# EAGLE schematic base (EAGLE 9.2.1)
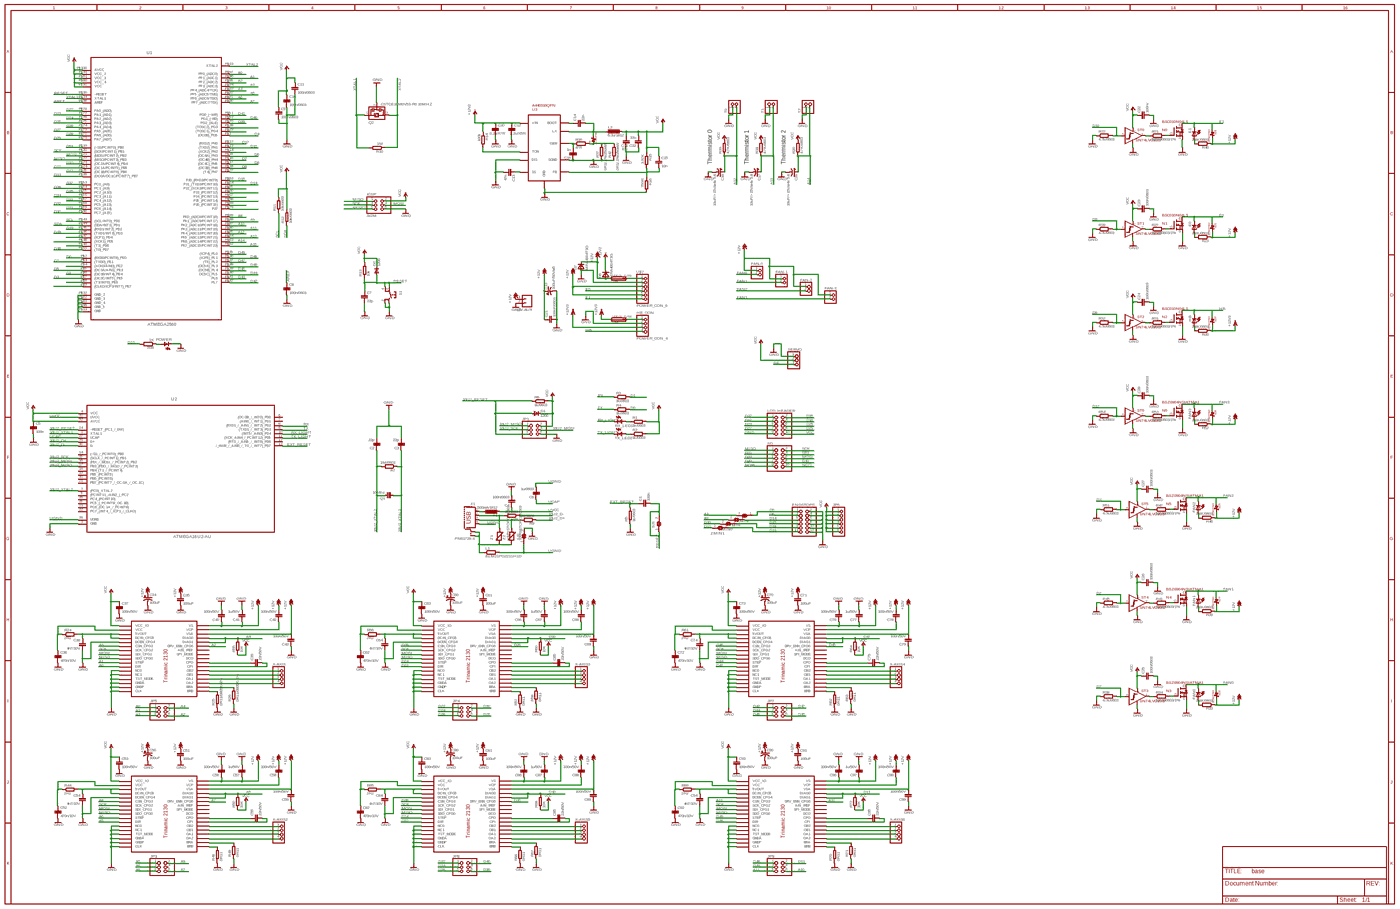
[diagram p0: schematic, sheet 1, overview]
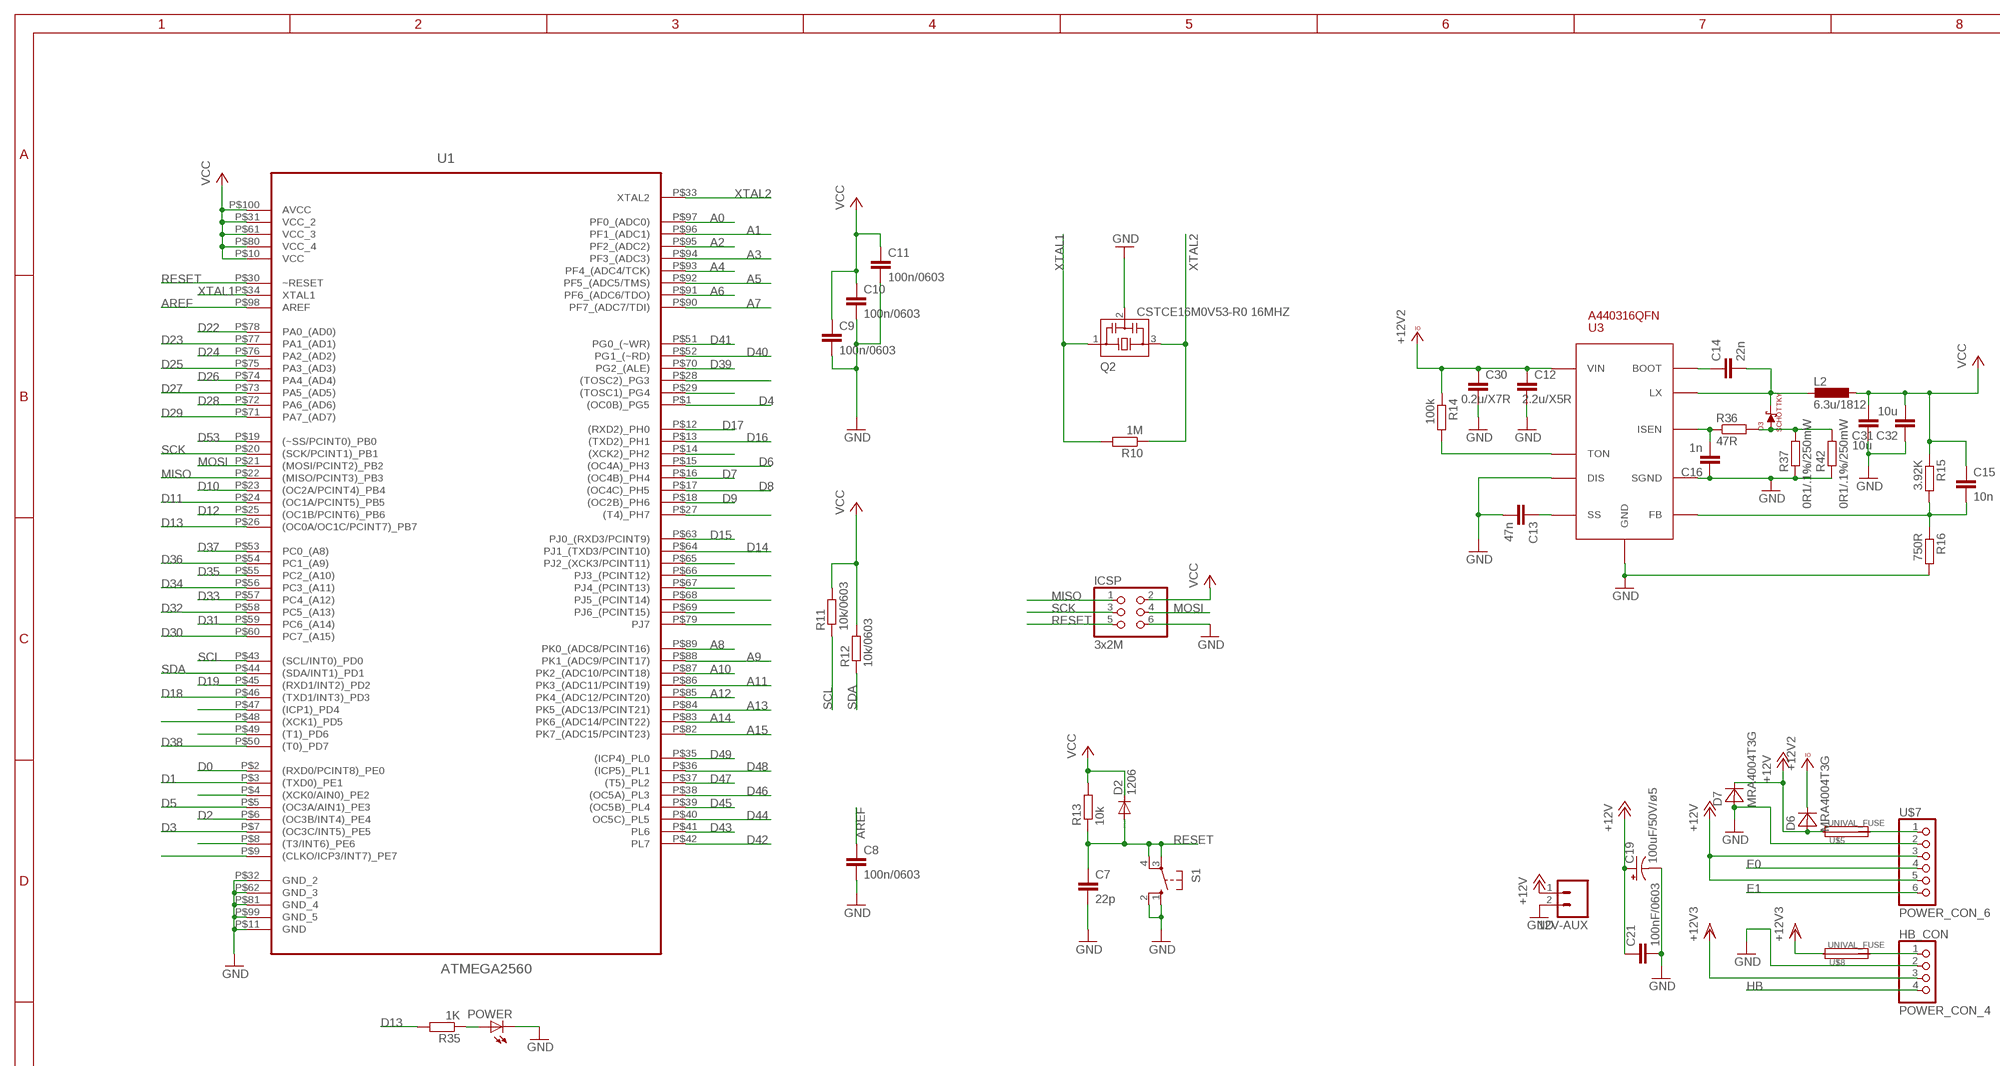
[diagram p1: schematic, sheet 1, part 1 of 4]
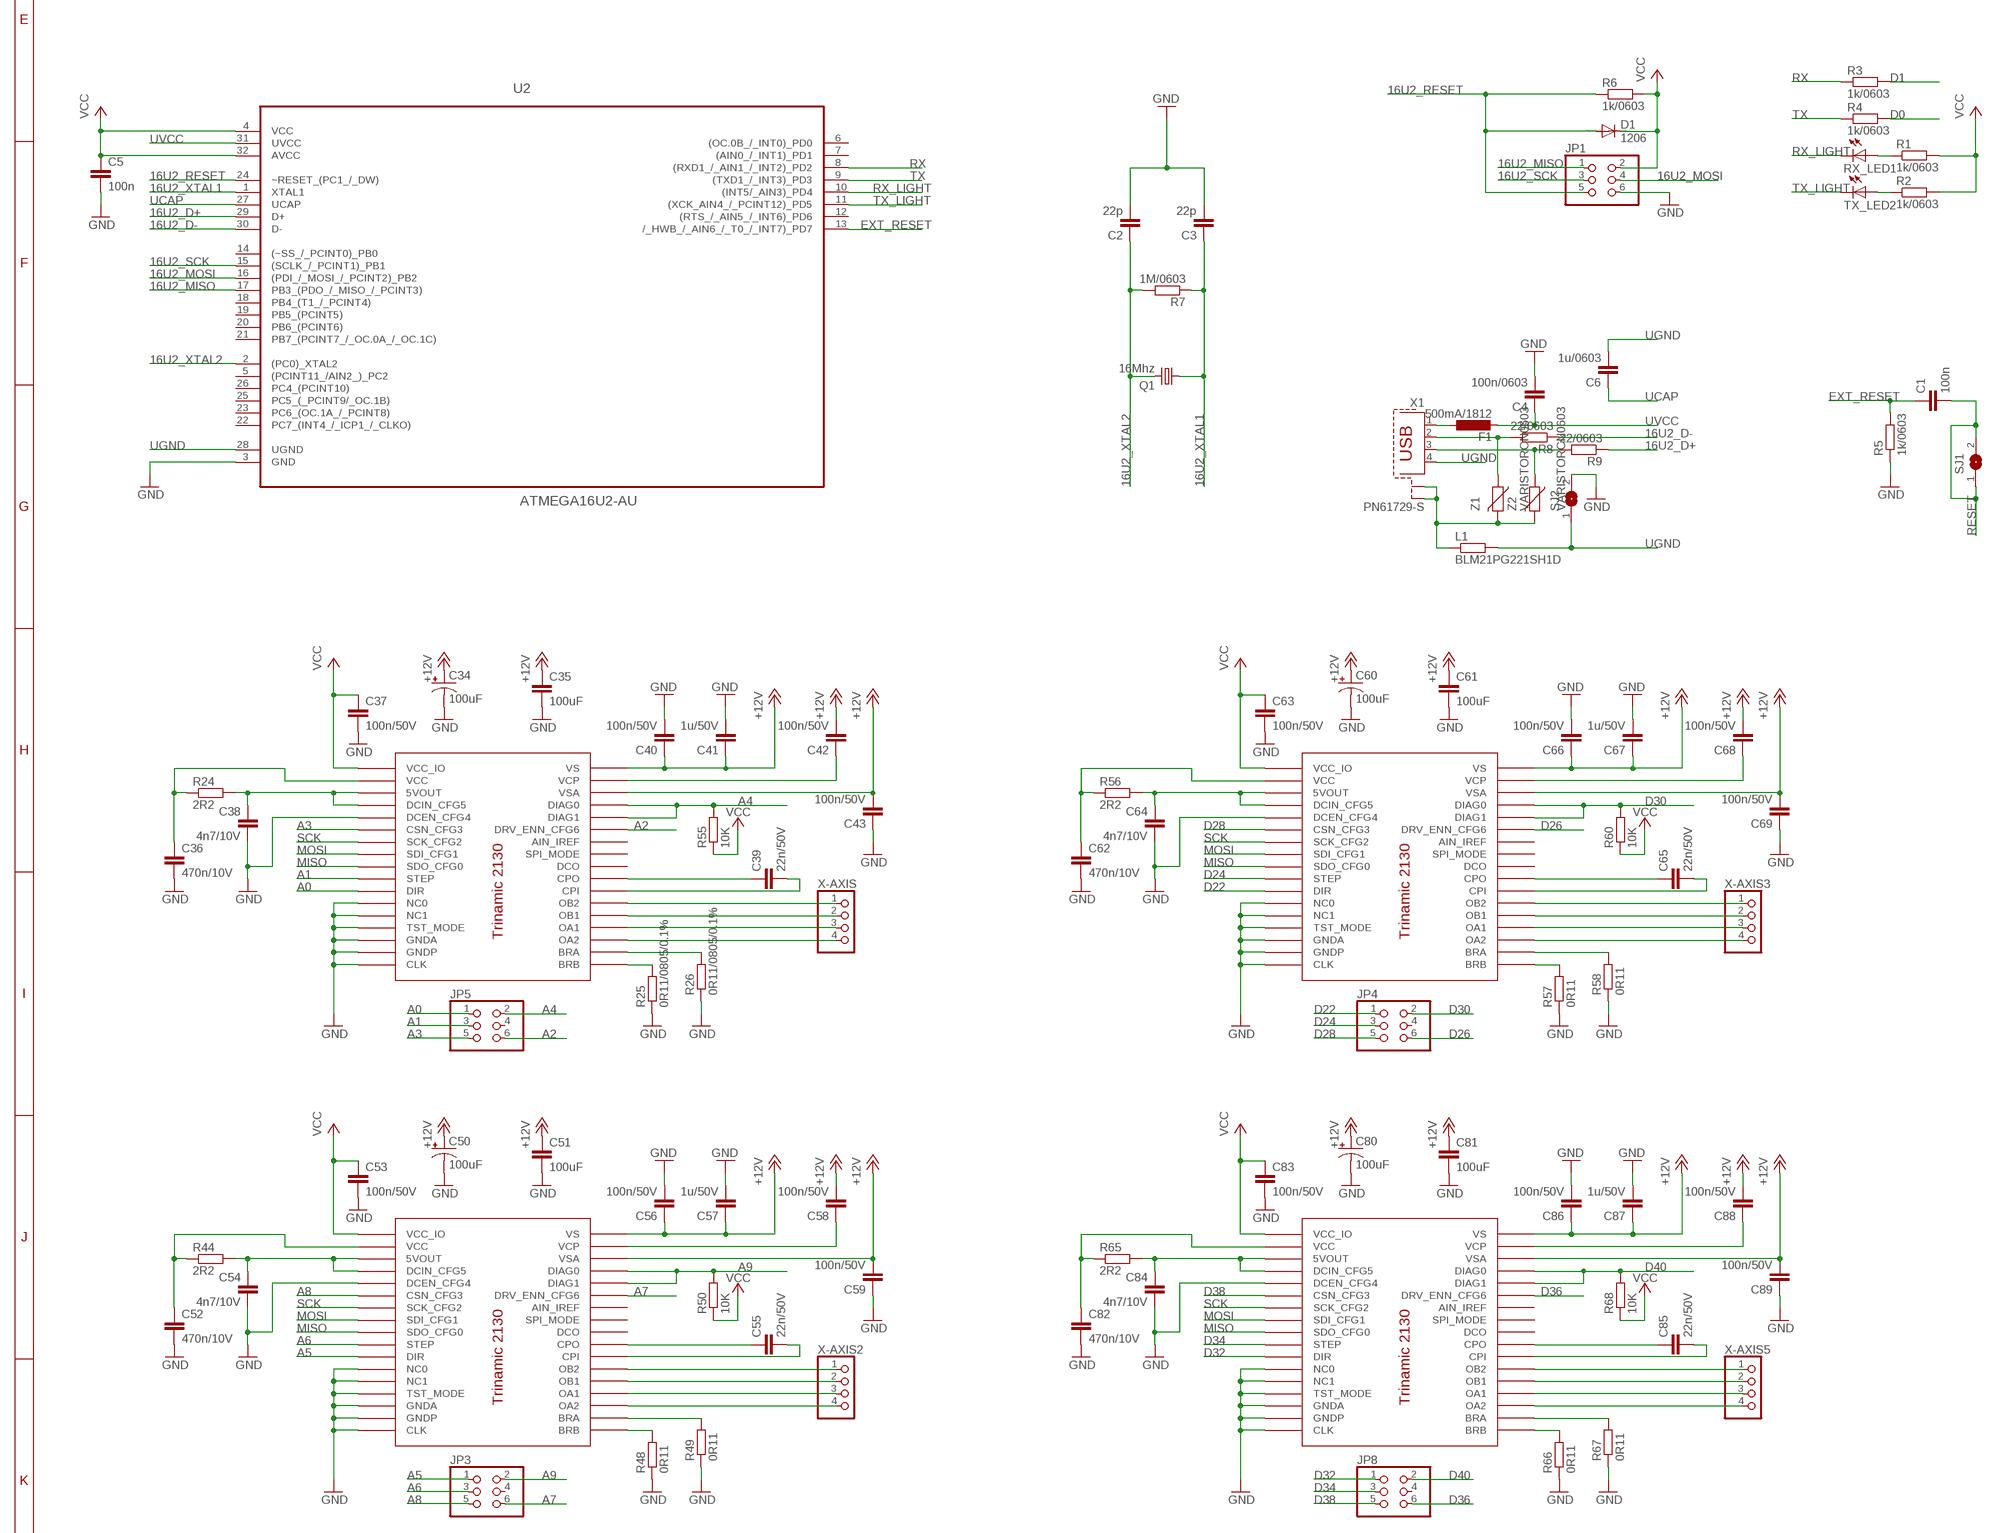
[diagram p2: schematic, sheet 1, part 2 of 4]
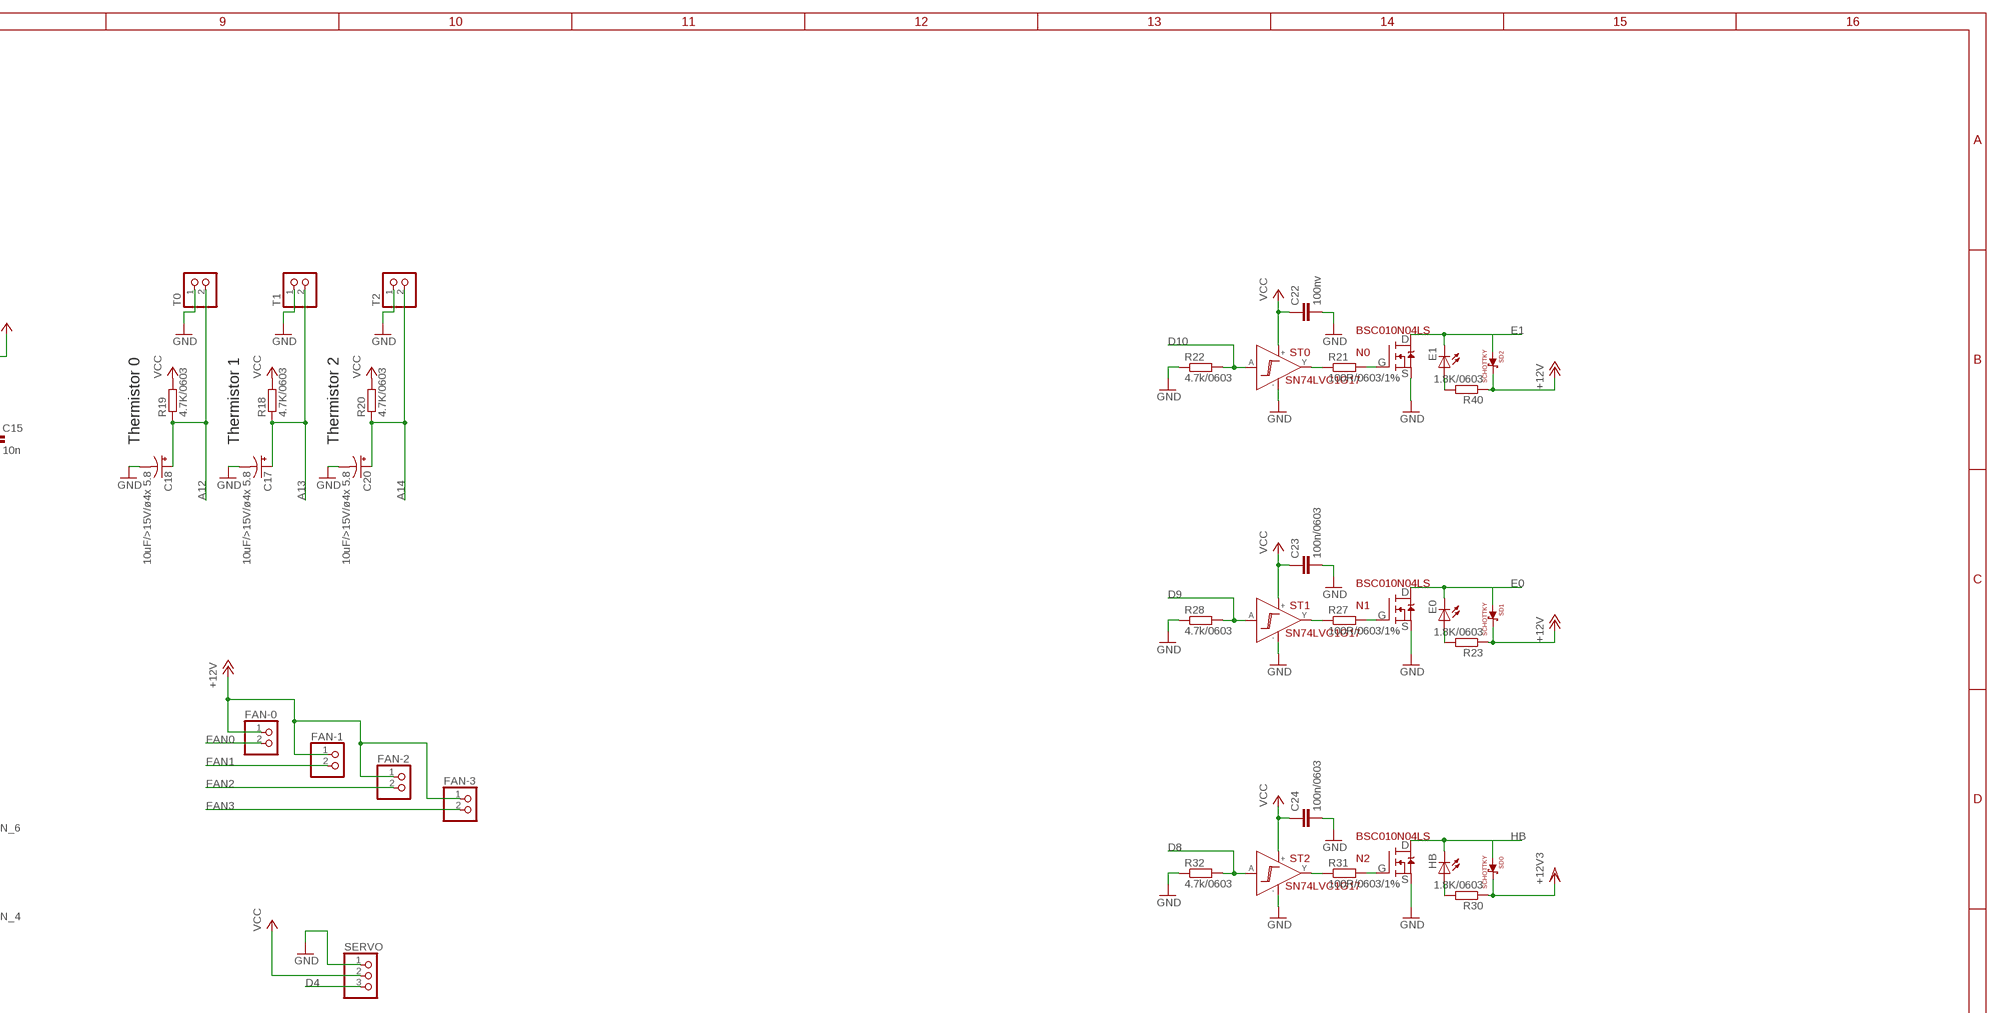
[diagram p3: schematic, sheet 1, part 3 of 4]
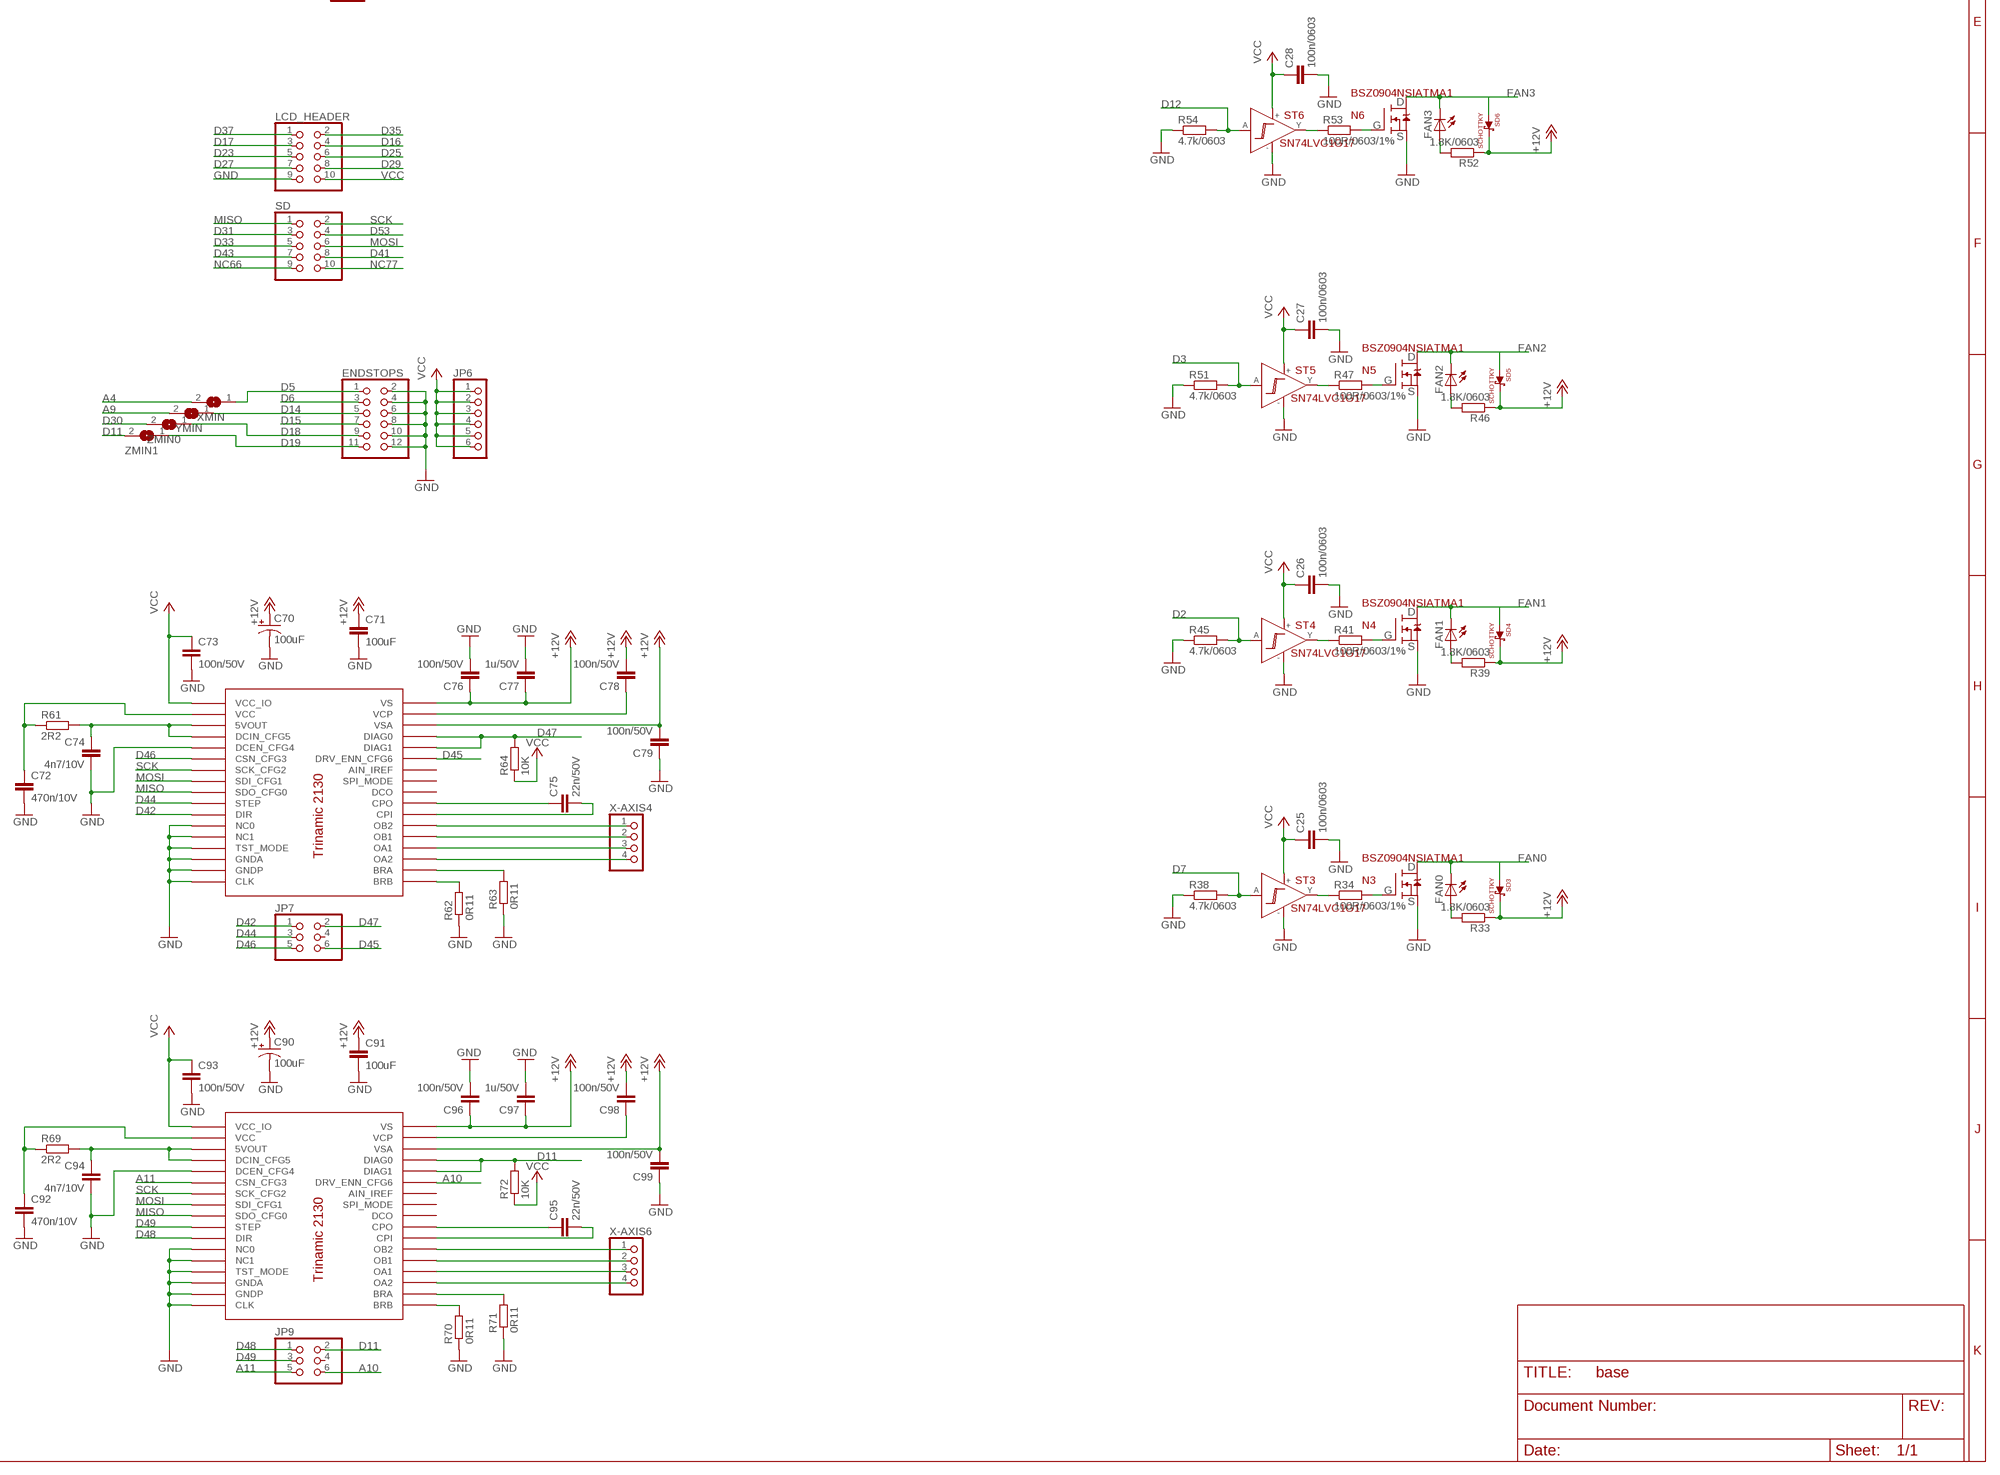
[diagram p4: schematic, sheet 1, part 4 of 4]

## Parts
12V-AUX  M02PTH  [1X02]
C1  100n  C-EUC0603  [C0603]
C2  22p  C-EUC0603  [C0603]
C3  22p  C-EUC0603  [C0603]
C4  100n/0603  C-EUC0603  [C0603]
C5  100n  C-EUC0603  [C0603]
C6  1u/0603  C-EUC0603  [C0603]
C7  22p  C-EUC0603  [C0603]
C8  100n/0603  C-EUC0603  [C0603]
C9  100n/0603  C-EUC0603  [C0603]
C10  100n/0603  C-EUC0603  [C0603]
C11  100n/0603  C-EUC0603  [C0603]
C12  2.2u/X5R  C-EUC0805  [C0805]
C13  47n  C-EUC0603  [C0603]
C14  22n  C-EUC0603  [C0603]
C15  10n  C-EUC0603  [C0603]
C16  1n  C-EUC0603  [C0603]
C17  10uF/>15V/ø4x 5.8  CPOL-US153CLV-0405  [153CLV-0405]
C18  10uF/>15V/ø4x 5.8  CPOL-US153CLV-0405  [153CLV-0405]
C19  100uF/50V/ø5  CPOL-US153CLV-0605  [153CLV-0605]
C20  10uF/>15V/ø4x 5.8  CPOL-US153CLV-0405  [153CLV-0405]
C21  100nF/0603  C-EUC0805  [C0805]
C22  100nv  C-EUC0603  [C0603]
C23  100n/0603  C-EUC0603  [C0603]
C24  100n/0603  C-EUC0603  [C0603]
C25  100n/0603  C-EUC0603  [C0603]
C26  100n/0603  C-EUC0603  [C0603]
C27  100n/0603  C-EUC0603  [C0603]
C28  100n/0603  C-EUC0603  [C0603]
C30  0.2u/X7R  C-EUC0603  [C0603]
C31  10u  C-EUC0603  [C0603]
C32  10u  C-EUC0603  [C0603]
C34  100uF  CPOL-US153CLV-0605  [153CLV-0605]
C35  100uF  C-EUC0603  [C0603]
C36  470n/10V  C-EUC0402  [C0402]
C37  100n/50V  C-EUC0402  [C0402]
C38  4n7/10V  C-EUC0402  [C0402]
C39  22n/50V  C-EUC0402  [C0402]
C40  100n/50V  C-EUC0402  [C0402]
C41  1u/50V  C-EUC0603  [C0603]
C42  100n/50V  C-EUC0402  [C0402]
C43  100n/50V  C-EUC0402  [C0402]
C50  100uF  CPOL-US153CLV-0605  [153CLV-0605]
C51  100uF  C-EUC0603  [C0603]
C52  470n/10V  C-EUC0402  [C0402]
C53  100n/50V  C-EUC0402  [C0402]
C54  4n7/10V  C-EUC0402  [C0402]
C55  22n/50V  C-EUC0402  [C0402]
C56  100n/50V  C-EUC0402  [C0402]
C57  1u/50V  C-EUC0603  [C0603]
C58  100n/50V  C-EUC0402  [C0402]
C59  100n/50V  C-EUC0402  [C0402]
C60  100uF  CPOL-US153CLV-0605  [153CLV-0605]
C61  100uF  C-EUC0603  [C0603]
C62  470n/10V  C-EUC0402  [C0402]
C63  100n/50V  C-EUC0402  [C0402]
C64  4n7/10V  C-EUC0402  [C0402]
C65  22n/50V  C-EUC0402  [C0402]
C66  100n/50V  C-EUC0402  [C0402]
C67  1u/50V  C-EUC0603  [C0603]
C68  100n/50V  C-EUC0402  [C0402]
C69  100n/50V  C-EUC0402  [C0402]
C70  100uF  CPOL-US153CLV-0605  [153CLV-0605]
C71  100uF  C-EUC0603  [C0603]
C72  470n/10V  C-EUC0402  [C0402]
C73  100n/50V  C-EUC0402  [C0402]
C74  4n7/10V  C-EUC0402  [C0402]
C75  22n/50V  C-EUC0402  [C0402]
C76  100n/50V  C-EUC0402  [C0402]
C77  1u/50V  C-EUC0603  [C0603]
C78  100n/50V  C-EUC0402  [C0402]
C79  100n/50V  C-EUC0402  [C0402]
C80  100uF  CPOL-US153CLV-0605  [153CLV-0605]
C81  100uF  C-EUC0603  [C0603]
C82  470n/10V  C-EUC0402  [C0402]
C83  100n/50V  C-EUC0402  [C0402]
C84  4n7/10V  C-EUC0402  [C0402]
C85  22n/50V  C-EUC0402  [C0402]
C86  100n/50V  C-EUC0402  [C0402]
C87  1u/50V  C-EUC0603  [C0603]
C88  100n/50V  C-EUC0402  [C0402]
C89  100n/50V  C-EUC0402  [C0402]
C90  100uF  CPOL-US153CLV-0605  [153CLV-0605]
C91  100uF  C-EUC0603  [C0603]
C92  470n/10V  C-EUC0402  [C0402]
C93  100n/50V  C-EUC0402  [C0402]
C94  4n7/10V  C-EUC0402  [C0402]
C95  22n/50V  C-EUC0402  [C0402]
C96  100n/50V  C-EUC0402  [C0402]
C97  1u/50V  C-EUC0603  [C0603]
C98  100n/50V  C-EUC0402  [C0402]
C99  100n/50V  C-EUC0402  [C0402]
D1  1206  DIODE-MICROMELF-W  [MICROMELF-W]
D2  1206  DIODE-MINIMELF  [MINIMELF]
D3  SCHOTTKY  [MICROSMP]
D6  MRA4004T3G  [SMA]
D7  MRA4004T3G  [SMA]
E0  LEDCHIP-LED0805  [CHIP-LED0805]
E1  LEDCHIP-LED0805  [CHIP-LED0805]
ENDSTOPS  PINHD-2X6/90  [2X06/90]
F1  500mA/1812  L-EUL1812  [L1812]
FAN0  LEDCHIP-LED0805  [CHIP-LED0805]
FAN1  LEDCHIP-LED0805  [CHIP-LED0805]
FAN2  LEDCHIP-LED0805  [CHIP-LED0805]
FAN3  LEDCHIP-LED0805  [CHIP-LED0805]
FAN-0  PINHD-1X2  [1X02]
FAN-1  PINHD-1X2  [1X02]
FAN-2  PINHD-1X2  [1X02]
FAN-3  PINHD-1X2  [1X02]
HB  LEDCHIP-LED0805  [CHIP-LED0805]
HB_CON  POWER_CON_4  [POWER_CON_4]
ICSP  3x2M  PINHD-2X3  [2X03]
JP1  PINHD-2X3  [2X03]
JP3  PINHD-2X3  [2X03]
JP4  PINHD-2X3  [2X03]
JP5  PINHD-2X3  [2X03]
JP6  PINHD-1X6  [1X06]
JP7  PINHD-2X3  [2X03]
JP8  PINHD-2X3  [2X03]
JP9  PINHD-2X3  [2X03]
L1  BLM21PG221SH1D  R-EU_R0805  [R0805]
L2  6.3u/1812  L-EUL1812  [L1812]
LCD_HEADER  PINHD-2X5  [2X05]
N0  BSC010N04LS  [TDSON-8FL]
N1  BSC010N04LS  [TDSON-8FL]
N2  BSC010N04LS  [TDSON-8FL]
N3  BSZ0904NSIATMA1  [TSDSON-8]
N4  BSZ0904NSIATMA1  [TSDSON-8]
N5  BSZ0904NSIATMA1  [TSDSON-8]
N6  BSZ0904NSIATMA1  [TSDSON-8]
POWER  LEDCHIP-LED0805  [CHIP-LED0805]
Q1  16Mhz  CRYSTALHC49S  [HC49/S]
Q2  CSTCE16M0V53-R0 16MHZ  CSTCR6M00G53Z  [CSTCR6M]
R1  1k/0603  R-EU_R0603  [R0603]
R2  1k/0603  R-EU_R0603  [R0603]
R3  1k/0603  R-EU_R0603  [R0603]
R4  1k/0603  R-EU_R0603  [R0603]
R5  1k/0603  R-EU_R0603  [R0603]
R6  1k/0603  R-EU_R0603  [R0603]
R7  1M/0603  R-EU_R0603  [R0603]
R8  22/0603  R-EU_R0603  [R0603]
R9  22/0603  R-EU_R0603  [R0603]
R10  1M  R-EU_R0603  [R0603]
R11  10k/0603  R-EU_R0603  [R0603]
R12  10k/0603  R-EU_R0603  [R0603]
R13  10k  R-EU_R0805  [R0805]
R14  100k  R-EU_R0603  [R0603]
R15  3.92K  R-EU_R0603  [R0603]
R16  750R  R-EU_R0603  [R0603]
R18  4.7K/0603  R-EU_R0603  [R0603]
R19  4.7K/0603  R-EU_R0603  [R0603]
R20  4.7K/0603  R-EU_R0603  [R0603]
R21  100R/0603/1%  R-EU_R0603  [R0603]
R22  4.7k/0603  R-EU_R0603  [R0603]
R23  1.8K/0603  R-EU_R0603  [R0603]
R24  2R2  R-EU_R0402  [R0402]
R25  0R11/0805/0.1%  R-EU_R0805  [R0805]
R26  0R11/0805/0.1%  R-EU_R0805  [R0805]
R27  100R/0603/1%  R-EU_R0603  [R0603]
R28  4.7k/0603  R-EU_R0603  [R0603]
R30  1.8K/0603  R-EU_R0603  [R0603]
R31  100R/0603/1%  R-EU_R0603  [R0603]
R32  4.7k/0603  R-EU_R0603  [R0603]
R33  1.8K/0603  R-EU_R0603  [R0603]
R34  100R/0603/1%  R-EU_R0603  [R0603]
R35  1K  R-EU_R0603  [R0603]
R36  47R  R-EU_R0603  [R0603]
R37  0R1/.1%/250mW  R-EU_R0805  [R0805]
R38  4.7k/0603  R-EU_R0603  [R0603]
R39  1.8K/0603  R-EU_R0603  [R0603]
R40  1.8K/0603  R-EU_R0603  [R0603]
R41  100R/0603/1%  R-EU_R0603  [R0603]
R42  0R1/.1%/250mW  R-EU_R0805  [R0805]
R44  2R2  R-EU_R0402  [R0402]
R45  4.7k/0603  R-EU_R0603  [R0603]
R46  1.8K/0603  R-EU_R0603  [R0603]
R47  100R/0603/1%  R-EU_R0603  [R0603]
R48  0R11  R-EU_R0805  [R0805]
R49  0R11  R-EU_R0805  [R0805]
R50  10K  R-EU_R0603  [R0603]
R51  4.7k/0603  R-EU_R0603  [R0603]
R52  1.8K/0603  R-EU_R0603  [R0603]
R53  100R/0603/1%  R-EU_R0603  [R0603]
R54  4.7k/0603  R-EU_R0603  [R0603]
R55  10K  R-EU_R0603  [R0603]
R56  2R2  R-EU_R0402  [R0402]
R57  0R11  R-EU_R0805  [R0805]
R58  0R11  R-EU_R0805  [R0805]
R60  10K  R-EU_R0603  [R0603]
R61  2R2  R-EU_R0402  [R0402]
R62  0R11  R-EU_R0805  [R0805]
R63  0R11  R-EU_R0805  [R0805]
R64  10K  R-EU_R0603  [R0603]
R65  2R2  R-EU_R0402  [R0402]
R66  0R11  R-EU_R0805  [R0805]
R67  0R11  R-EU_R0805  [R0805]
R68  10K  R-EU_R0603  [R0603]
R69  2R2  R-EU_R0402  [R0402]
R70  0R11  R-EU_R0805  [R0805]
R71  0R11  R-EU_R0805  [R0805]
R72  10K  R-EU_R0603  [R0603]
RX_LED1  LEDSML0603  [SML0603]
S1  10-XX  [B3F-10XX]
SD  PINHD-2X5  [2X05]
SD0  SCHOTTKY  [MICROSMP]
SD1  SCHOTTKY  [MICROSMP]
SD2  SCHOTTKY  [MICROSMP]
SD3  SCHOTTKY  [MICROSMP]
SD4  SCHOTTKY  [MICROSMP]
SD5  SCHOTTKY  [MICROSMP]
SD6  SCHOTTKY  [MICROSMP]
SERVO  PINHD-1X3/90  [1X03/90]
SJ1  SJ  [SJ]
SJ2  SJ  [SJ]
ST0  SN74LVC1G17  [SOT23-5]
ST1  SN74LVC1G17  [SOT23-5]
ST2  SN74LVC1G17  [SOT23-5]
ST3  SN74LVC1G17  [SOT23-5]
ST4  SN74LVC1G17  [SOT23-5]
ST5  SN74LVC1G17  [SOT23-5]
ST6  SN74LVC1G17  [SOT23-5]
T0  PINHD-1X2  [1X02]
T1  PINHD-1X2  [1X02]
T2  PINHD-1X2  [1X02]
TX_LED2  LEDSML0603  [SML0603]
U1  ATMEGA2560  [100TQFP-ATMEGA2560]
U2  ATMEGA16U2-AU  [QFP80P900X900X120-32N]
U3  A440316QFN  [16QFN]
U$2  TRINAMIC2130  [36QFN-TRINAMIC2130]
U$3  TRINAMIC2130  [36QFN-TRINAMIC2130]
U$4  TRINAMIC2130  [36QFN-TRINAMIC2130]
U$5  UNIVAL_FUSE  [UNIVAL_FUSE]
U$6  TRINAMIC2130  [36QFN-TRINAMIC2130]
U$7  POWER_CON_6  [POWER_CON_6]
U$8  UNIVAL_FUSE  [UNIVAL_FUSE]
U$9  TRINAMIC2130  [36QFN-TRINAMIC2130]
U$10  TRINAMIC2130  [36QFN-TRINAMIC2130]
X1  PN61729-S  [PN61729-S]
X-AXIS  PINHD-1X4/90  [1X04/90]
X-AXIS2  PINHD-1X4/90  [1X04/90]
X-AXIS3  PINHD-1X4/90  [1X04/90]
X-AXIS4  PINHD-1X4/90  [1X04/90]
X-AXIS5  PINHD-1X4/90  [1X04/90]
X-AXIS6  PINHD-1X4/90  [1X04/90]
XMIN  SJ  [SJ]
YMIN  SJ  [SJ]
Z1  VARISTORCN0603  [CT/CN0603]
Z2  VARISTORCN0603  [CT/CN0603]
ZMIN0  SJ  [SJ]
ZMIN1  SJ  [SJ]

## Nets
16U2_D+: R9.1 U2.29(D+)
16U2_D-: R8.1 U2.30(D-)
16U2_MISO: JP1.1 U2.17(PB3_(PDO_/_MISO_/_PCINT3))
16U2_MOSI: JP1.4 U2.16((PDI_/_MOSI_/_PCINT2)_PB2)
16U2_RESET: D1.A JP1.5 R6.1 U2.24(~RESET_(PC1_/_DW))
16U2_SCK: JP1.3 U2.15((SCLK_/_PCINT1)_PB1)
16U2_XTAL1: C3.1 Q1.1 R7.1 U2.1(XTAL1)
16U2_XTAL2: C2.1 Q1.2 R7.2 U2.2((PC0)_XTAL2)
+12V: 12V-AUX.1 C19.+ C21.1 C34.+ C35.1 C40.1 C41.1 C42.2 C43.2 C50.+ C51.1 C56.1 C57.1 C58.2 C59.2 C60.+ C61.1 C66.1 C67.1 C68.2 C69.2 C70.+ C71.1 C76.1 C77.1 C78.2 C79.2 C80.+ C81.1 C86.1 C87.1 C88.2 C89.2 C90.+ C91.1 C96.1 C97.1 C98.2 C99.2 D6.A D7.C FAN-0.1 FAN-1.1 FAN-2.1 FAN-3.1 R23.1 R33.1 R39.1 R40.1 R46.1 R52.1 SD1.P$1 SD2.P$1 SD3.P$1 SD4.P$1 SD5.P$1 SD6.P$1 U$2.VS1(VS) U$2.VS2(VS) U$2.VSA U$3.VS1(VS) U$3.VS2(VS) U$3.VSA U$4.VS1(VS) U$4.VS2(VS) U$4.VSA U$5.P$1 U$5.P$3 U$6.VS1(VS) U$6.VS2(VS) U$6.VSA U$7.3 U$7.5 U$9.VS1(VS) U$9.VS2(VS) U$9.VSA U$10.VS1(VS) U$10.VS2(VS) U$10.VSA
A0: JP5.1 U1.P$97(PF0_(ADC0)) U$2.DIR
A1: JP5.3 U1.P$96(PF1_(ADC1)) U$2.STEP
A2: JP5.6 U1.P$95(PF2_(ADC2)) U$2.DRV_ENN_CFG6
A3: JP5.5 U1.P$94(PF3_(ADC3)) U$2.CSN_CFG3
A4: JP5.2 R55.2 U1.P$93(PF4_(ADC4/TCK)) U$2.DIAG0 U$2.DIAG1 XMIN.2
A5: JP3.1 U1.P$92(PF5_(ADC5/TMS)) U$4.DIR
A6: JP3.3 U1.P$91(PF6_(ADC6/TDO)) U$4.STEP
A7: JP3.6 U1.P$90(PF7_(ADC7/TDI)) U$4.DRV_ENN_CFG6
A8: JP3.5 U1.P$89(PK0_(ADC8/PCINT16)) U$4.CSN_CFG3
A9: JP3.2 R50.2 U1.P$88(PK1_(ADC9/PCINT17)) U$4.DIAG0 U$4.DIAG1 YMIN.2
A10: JP9.6 U1.P$87(PK2_(ADC10/PCINT18)) U$10.DRV_ENN_CFG6
A11: JP9.5 U1.P$86(PK3_(ADC11/PCINT19)) U$10.CSN_CFG3
A12: C18.+ R19.1 T0.2 U1.P$85(PK4_(ADC12/PCINT20))
A13: C17.+ R18.1 T1.2 U1.P$84(PK5_(ADC13/PCINT21))
A14: C20.+ R20.1 T2.2 U1.P$83(PK6_(ADC14/PCINT22))
A15: U1.P$82(PK7_(ADC15/PCINT23))
AREF: C8.1 U1.P$98(AREF)
D0: R4.2 U1.P$2((RXD0/PCINT8)_PE0)
D1: R3.2 U1.P$3((TXD0)_PE1)
D2: R45.2 ST4.P$2 U1.P$6((OC3B/INT4)_PE4)
D3: R51.2 ST5.P$2 U1.P$7((OC3C/INT5)_PE5)
D4: SERVO.3 U1.P$1((OC0B)_PG5)
D5: ENDSTOPS.1 U1.P$5((OC3A/AIN1)_PE3) XMIN.1
D6: ENDSTOPS.3 U1.P$15((OC4A)_PH3)
D7: R38.2 ST3.P$2 U1.P$16((OC4B)_PH4)
D8: R32.2 ST2.P$2 U1.P$17((OC4C)_PH5)
D9: R28.2 ST1.P$2 U1.P$18((OC2B)_PH6)
D10: R22.2 ST0.P$2 U1.P$23((OC2A/PCINT4)_PB4)
D11: JP9.2 R72.2 U1.P$24((OC1A/PCINT5)_PB5) U$10.DIAG0 U$10.DIAG1 ZMIN1.2
D12: R54.2 ST6.P$2 U1.P$25((OC1B/PCINT6)_PB6)
D13: R35.2 U1.P$26((OC0A/OC1C/PCINT7)_PB7)
D14: ENDSTOPS.5 U1.P$64(PJ1_(TXD3/PCINT10)) YMIN.1
D15: ENDSTOPS.7 U1.P$63(PJ0_(RXD3/PCINT9))
D16: LCD_HEADER.4 U1.P$13((TXD2)_PH1)
D17: LCD_HEADER.3 U1.P$12((RXD2)_PH0)
D18: ENDSTOPS.9 U1.P$46((TXD1/INT3)_PD3) ZMIN0.1
D19: ENDSTOPS.11 U1.P$45((RXD1/INT2)_PD2) ZMIN1.1
D22: JP4.1 U1.P$78(PA0_(AD0)) U$3.DIR
D23: LCD_HEADER.5 U1.P$77(PA1_(AD1))
D24: JP4.3 U1.P$76(PA2_(AD2)) U$3.STEP
D25: LCD_HEADER.6 U1.P$75(PA3_(AD3))
D26: JP4.6 U1.P$74(PA4_(AD4)) U$3.DRV_ENN_CFG6
D27: LCD_HEADER.7 U1.P$73(PA5_(AD5))
D28: JP4.5 U1.P$72(PA6_(AD6)) U$3.CSN_CFG3
D29: LCD_HEADER.8 U1.P$71(PA7_(AD7))
D30: JP4.2 R60.2 U1.P$60(PC7_(A15)) U$3.DIAG0 U$3.DIAG1 ZMIN0.2
D31: SD.3 U1.P$59(PC6_(A14))
D32: JP8.1 U1.P$58(PC5_(A13)) U$9.DIR
D33: SD.5 U1.P$57(PC4_(A12))
D34: JP8.3 U1.P$56(PC3_(A11)) U$9.STEP
D35: LCD_HEADER.2 U1.P$55(PC2_(A10))
D36: JP8.6 U1.P$54(PC1_(A9)) U$9.DRV_ENN_CFG6
D37: LCD_HEADER.1 U1.P$53(PC0_(A8))
D38: JP8.5 U1.P$50((T0)_PD7) U$9.CSN_CFG3
D39: U1.P$70(PG2_(ALE))
D40: JP8.2 R68.2 U1.P$52(PG1_(~RD)) U$9.DIAG0 U$9.DIAG1
D41: SD.8 U1.P$51(PG0_(~WR))
D42: JP7.1 U1.P$42(PL7) U$6.DIR
D43: SD.7 U1.P$41(PL6)
D44: JP7.3 U1.P$40(OC5C)_PL5) U$6.STEP
D45: JP7.6 U1.P$39((OC5B)_PL4) U$6.DRV_ENN_CFG6
D46: JP7.5 U1.P$38((OC5A)_PL3) U$6.CSN_CFG3
D47: JP7.2 R64.2 U1.P$37((T5)_PL2) U$6.DIAG0 U$6.DIAG1
D48: JP9.1 U1.P$36((ICP5)_PL1) U$10.DIR
D49: JP9.3 U1.P$35((ICP4)_PL0) U$10.STEP
D53: SD.4 U1.P$19((~SS/PCINT0)_PB0)
E0: E0.C N1.D N1.P$2(D) N1.P$3(D) N1.P$4(D) N1.P$5(D) SD1.P$2 U$7.4
E1: E1.C N0.D N0.P$2(D) N0.P$3(D) N0.P$4(D) N0.P$5(D) SD2.P$2 U$7.6
EXT_RESET: C1.1 R5.2 U2.13(/_HWB_/_AIN6_/_T0_/_INT7)_PD7)
FAN0: FAN0.C FAN-0.2 N3.D SD3.P$2
FAN1: FAN1.C FAN-1.2 N4.D SD4.P$2
FAN2: FAN2.C FAN-2.2 N5.D SD5.P$2
FAN3: FAN3.C FAN-3.2 N6.D SD6.P$2
GND: 12V-AUX.2 C2.2 C3.2 C4.2 C5.2 C7.2 C8.2 C9.2 C10.2 C11.2 C12.2 C13.2 C16.1 C17.- C18.- C19.- C20.- C21.2 C22.2 C23.2 C24.2 C25.2 C26.2 C27.2 C28.2 C30.2 C31.1 C32.1 C34.- C35.2 C36.2 C37.2 C38.2 C40.2 C41.2 C43.1 C50.- C51.2 C52.2 C53.2 C54.2 C56.2 C57.2 C59.1 C60.- C61.2 C62.2 C63.2 C64.2 C66.2 C67.2 C69.1 C70.- C71.2 C72.2 C73.2 C74.2 C76.2 C77.2 C79.1 C80.- C81.2 C82.2 C83.2 C84.2 C86.2 C87.2 C89.1 C90.- C91.2 C92.2 C93.2 C94.2 C96.2 C97.2 C99.1 D7.A ENDSTOPS.2 ENDSTOPS.4 ENDSTOPS.6 ENDSTOPS.8 ENDSTOPS.10 ENDSTOPS.12 HB_CON.2 ICSP.6 JP1.6 LCD_HEADER.9 N0.S N1.S N2.S N3.S N4.S N5.S N6.S POWER.C Q2.2 R5.1 R16.2 R22.1 R25.1 R26.1 R28.1 R32.1 R37.1 R38.1 R42.1 R45.1 R48.1 R49.1 R51.1 R54.1 R57.1 R58.1 R62.1 R63.1 R66.1 R67.1 R70.1 R71.1 S1.1(S) S1.2(S1) SERVO.1 SJ2.2 ST0.P$3 ST1.P$3 ST2.P$3 ST3.P$3 ST4.P$3 ST5.P$3 ST6.P$3 T0.1 T1.1 T2.1 U1.P$11(GND) U1.P$32(GND_2) U1.P$62(GND_3) U1.P$81(GND_4) U1.P$99(GND_5) U2.3(GND) U3.2(GND) U3.7(GND) U3.13(GND) U3.14(GND) U3.15(GND) U3.16(GND) U3.DIS U3.GND U3.PAD(GND) U3.SGND U$2.-(NC0) U$2.CLK U$2.DCEN_CFG4 U$2.GND(GNDA) U$2.GNDA U$2.GNDP1(GNDP) U$2.GNDP2(GNDP) U$2.NC2(NC1) U$2.P$37(GNDA) U$2.P$38(GNDA) U$2.P$39(GNDA) U$2.P$40(GNDA) U$2.P$41(GNDA) U$2.P$42(GNDA) U$2.P$43(GNDA) U$2.P$44(GNDA) U$2.P$45(GNDA) U$2.P$46(GNDA) U$2.P$47(GNDA) U$2.P$48(GNDA) U$2.P$49(GNDA) U$2.P$50(GNDA) U$2.P$51(GNDA) U$2.P$52(GNDA) U$2.TST_MODE U$3.-(NC0) U$3.CLK U$3.DCEN_CFG4 U$3.GND(GNDA) U$3.GNDA U$3.GNDP1(GNDP) U$3.GNDP2(GNDP) U$3.NC2(NC1) U$3.P$37(GNDA) U$3.P$38(GNDA) U$3.P$39(GNDA) U$3.P$40(GNDA) U$3.P$41(GNDA) U$3.P$42(GNDA) U$3.P$43(GNDA) U$3.P$44(GNDA) U$3.P$45(GNDA) U$3.P$46(GNDA) U$3.P$47(GNDA) U$3.P$48(GNDA) U$3.P$49(GNDA) U$3.P$50(GNDA) U$3.P$51(GNDA) U$3.P$52(GNDA) U$3.TST_MODE U$4.-(NC0) U$4.CLK U$4.DCEN_CFG4 U$4.GND(GNDA) U$4.GNDA U$4.GNDP1(GNDP) U$4.GNDP2(GNDP) U$4.NC2(NC1) U$4.P$37(GNDA) U$4.P$38(GNDA) U$4.P$39(GNDA) U$4.P$40(GNDA) U$4.P$41(GNDA) U$4.P$42(GNDA) U$4.P$43(GNDA) U$4.P$44(GNDA) U$4.P$45(GNDA) U$4.P$46(GNDA) U$4.P$47(GNDA) U$4.P$48(GNDA) U$4.P$49(GNDA) U$4.P$50(GNDA) U$4.P$51(GNDA) U$4.P$52(GNDA) U$4.TST_MODE U$6.-(NC0) U$6.CLK U$6.DCEN_CFG4 U$6.GND(GNDA) U$6.GNDA U$6.GNDP1(GNDP) U$6.GNDP2(GNDP) U$6.NC2(NC1) U$6.P$37(GNDA) U$6.P$38(GNDA) U$6.P$39(GNDA) U$6.P$40(GNDA) U$6.P$41(GNDA) U$6.P$42(GNDA) U$6.P$43(GNDA) U$6.P$44(GNDA) U$6.P$45(GNDA) U$6.P$46(GNDA) U$6.P$47(GNDA) U$6.P$48(GNDA) U$6.P$49(GNDA) U$6.P$50(GNDA) U$6.P$51(GNDA) U$6.P$52(GNDA) U$6.TST_MODE U$7.2 U$9.-(NC0) U$9.CLK U$9.DCEN_CFG4 U$9.GND(GNDA) U$9.GNDA U$9.GNDP1(GNDP) U$9.GNDP2(GNDP) U$9.NC2(NC1) U$9.P$37(GNDA) U$9.P$38(GNDA) U$9.P$39(GNDA) U$9.P$40(GNDA) U$9.P$41(GNDA) U$9.P$42(GNDA) U$9.P$43(GNDA) U$9.P$44(GNDA) U$9.P$45(GNDA) U$9.P$46(GNDA) U$9.P$47(GNDA) U$9.P$48(GNDA) U$9.P$49(GNDA) U$9.P$50(GNDA) U$9.P$51(GNDA) U$9.P$52(GNDA) U$9.TST_MODE U$10.-(NC0) U$10.CLK U$10.DCEN_CFG4 U$10.GND(GNDA) U$10.GNDA U$10.GNDP1(GNDP) U$10.GNDP2(GNDP) U$10.NC2(NC1) U$10.P$37(GNDA) U$10.P$38(GNDA) U$10.P$39(GNDA) U$10.P$40(GNDA) U$10.P$41(GNDA) U$10.P$42(GNDA) U$10.P$43(GNDA) U$10.P$44(GNDA) U$10.P$45(GNDA) U$10.P$46(GNDA) U$10.P$47(GNDA) U$10.P$48(GNDA) U$10.P$49(GNDA) U$10.P$50(GNDA) U$10.P$51(GNDA) U$10.P$52(GNDA) U$10.TST_MODE
HB: HB.C HB_CON.4 N2.D N2.P$2(D) N2.P$3(D) N2.P$4(D) N2.P$5(D) SD0.P$2
MISO: ICSP.1 SD.1 U1.P$22((MISO/PCINT3)_PB3) U$2.SDO_CFG0 U$3.SDO_CFG0 U$4.SDO_CFG0 U$6.SDO_CFG0 U$9.SDO_CFG0 U$10.SDO_CFG0
MOSI: ICSP.4 SD.6 U1.P$21((MOSI/PCINT2)_PB2) U$2.SDI_CFG1 U$3.SDI_CFG1 U$4.SDI_CFG1 U$6.SDI_CFG1 U$9.SDI_CFG1 U$10.SDI_CFG1
N$1: R8.2 X1.2 Z1.1
N$2: R1.1 RX_LED1.A
N$3: R9.2 X1.3 Z2.1
N$4: R2.1 TX_LED2.A
N$5: F1.1 X1.1
N$6: L1.1 X1.S1 X1.S2 Z1.2 Z2.2
N$7: R14.2 U3.TON
N$8: C14.1 U3.BOOT
N$9: N3.G R34.2
N$10: HB_CON.1 U$8.P$2 U$8.P$4
N$11: C14.2 D3.P$1 L2.2 U3.LX
N$12: U$5.P$2 U$5.P$4 U$7.1
N$13: U1.P$47((ICP1)_PD4)
N$14: C13.1 U3.SS
N$15: POWER.A R35.1
N$16: R21.1 ST0.P$4
N$17: N1.G R27.2
N$18: E0.A R23.2
N$19: R27.1 ST1.P$4
N$20: N2.G R31.2
N$23: D3.P$2 R36.2 R37.2 R42.2
N$24: C16.2 R36.1 U3.ISEN
N$25: HB.A R30.2
N$26: R31.1 ST2.P$4
N$27: FAN0.A R33.2
N$28: R34.1 ST3.P$4
N$29: N4.G R41.2
N$30: FAN1.A R39.2
N$31: R41.1 ST4.P$4
N$32: N5.G R47.2
N$33: C38.1 R24.2 U$2.5VOUT U$2.DCIN_CFG5
N$34: C36.1 R24.1 U$2.VCC
N$35: U$2.OB2 X-AXIS.1
N$36: R25.2 U$2.BRB
N$37: R26.2 U$2.BRA
N$38: C39.1 U$2.CPO
N$39: C39.2 U$2.CPI
N$40: C42.1 U$2.VCP
N$41: U$2.OB1 X-AXIS.2
N$42: U$2.OA1 X-AXIS.3
N$43: U$2.OA2 X-AXIS.4
N$44: FAN2.A R46.2
N$45: R47.1 ST5.P$4
N$46: N6.G R53.2
N$47: FAN3.A R52.2
N$50: C15.2 R15.2 R16.1 U3.FB
N$55: C54.1 R44.2 U$4.5VOUT U$4.DCIN_CFG5
N$56: C52.1 R44.1 U$4.VCC
N$57: U$4.OB2 X-AXIS2.1
N$58: R48.2 U$4.BRB
N$59: R53.1 ST6.P$4
N$60: R49.2 U$4.BRA
N$61: C55.1 U$4.CPO
N$62: C55.2 U$4.CPI
N$63: N0.G R21.2
N$64: E1.A R40.2
N$65: C58.1 U$4.VCP
N$66: U$4.OB1 X-AXIS2.2
N$69: U1.P$48((XCK1)_PD5)
N$70: U1.P$49((T1)_PD6)
N$72: U$4.OA1 X-AXIS2.3
N$73: U$4.OA2 X-AXIS2.4
N$74: C64.1 R56.2 U$3.5VOUT U$3.DCIN_CFG5
N$75: U1.P$4((XCK0/AIN0)_PE2)
N$76: C62.1 R56.1 U$3.VCC
N$77: U$3.OB2 X-AXIS3.1
N$78: R57.2 U$3.BRB
N$79: U1.P$8((T3/INT6)_PE6)
N$80: U1.P$9((CLKO/ICP3/INT7)_PE7)
N$81: R58.2 U$3.BRA
N$82: C65.1 U$3.CPO
N$83: C65.2 U$3.CPI
N$84: C68.1 U$3.VCP
N$85: U$3.OB1 X-AXIS3.2
N$86: U$3.OA1 X-AXIS3.3
N$87: U$3.OA2 X-AXIS3.4
N$88: C74.1 R61.2 U$6.5VOUT U$6.DCIN_CFG5
N$89: C72.1 R61.1 U$6.VCC
N$90: U$6.OB2 X-AXIS4.1
N$91: R62.2 U$6.BRB
N$92: R63.2 U$6.BRA
N$93: C75.1 U$6.CPO
N$94: C75.2 U$6.CPI
N$95: C78.1 U$6.VCP
N$96: U$6.OB1 X-AXIS4.2
N$97: U$6.OA1 X-AXIS4.3
N$98: U$6.OA2 X-AXIS4.4
N$99: C84.1 R65.2 U$9.5VOUT U$9.DCIN_CFG5
N$100: C82.1 R65.1 U$9.VCC
N$101: U$9.OB2 X-AXIS5.1
N$102: R66.2 U$9.BRB
N$103: R67.2 U$9.BRA
N$104: C85.1 U$9.CPO
N$105: C85.2 U$9.CPI
N$106: C88.1 U$9.VCP
N$107: U$9.OB1 X-AXIS5.2
N$108: U$9.OA1 X-AXIS5.3
N$109: U$9.OA2 X-AXIS5.4
N$110: C94.1 R69.2 U$10.5VOUT U$10.DCIN_CFG5
N$111: C92.1 R69.1 U$10.VCC
N$112: U$10.OB2 X-AXIS6.1
N$113: R70.2 U$10.BRB
N$114: R71.2 U$10.BRA
N$115: C95.1 U$10.CPO
N$116: U1.P$28((TOSC2)_PG3)
N$117: U1.P$29((TOSC1)_PG4)
N$118: C95.2 U$10.CPI
N$119: C98.1 U$10.VCP
N$120: U$10.OB1 X-AXIS6.2
N$121: U1.P$14((XCK2)_PH2)
N$122: U$10.OA1 X-AXIS6.3
N$123: U$10.OA2 X-AXIS6.4
N$126: U1.P$27((T4)_PH7)
N$129: U1.P$65(PJ2_(XCK3/PCINT11))
N$130: U1.P$66(PJ3_(PCINT12))
N$131: U1.P$67(PJ4_(PCINT13))
N$132: U1.P$68(PJ5_(PCINT14))
N$133: U1.P$69(PJ6_(PCINT15))
N$134: U1.P$79(PJ7)
NC66: SD.9
NC77: SD.10
RESET: C1.2 C7.1 D2.A ICSP.5 R13.1 S1.3(P) S1.4(P1) SJ1.1 SJ1.2 U1.P$30(~RESET)
RX: R3.1 U2.8((RXD1_/_AIN1_/_INT2)_PD2)
RX_LIGHT: RX_LED1.C U2.10((INT5/_AIN3)_PD4)
SCK: ICSP.3 SD.2 U1.P$20((SCK/PCINT1)_PB1) U$2.SCK_CFG2 U$3.SCK_CFG2 U$4.SCK_CFG2 U$6.SCK_CFG2 U$9.SCK_CFG2 U$10.SCK_CFG2
SCL: R11.1 U1.P$43((SCL/INT0)_PD0)
SDA: R12.1 U1.P$44((SDA/INT1)_PD1)
TX: R4.1 U2.9((TXD1_/_INT3)_PD3)
TX_LIGHT: TX_LED2.C U2.11((XCK_AIN4_/_PCINT12)_PD5)
UCAP: C6.1 U2.27(UCAP)
UGND: C6.2 L1.2 SJ2.1 U2.28(UGND) X1.4
UVCC: C4.1 F1.2 U2.31(UVCC)
VCC: C5.1 C9.1 C10.1 C11.1 C15.1 C22.1 C23.1 C24.1 C25.1 C26.1 C27.1 C28.1 C31.2 C32.2 C37.1 C53.1 C63.1 C73.1 C83.1 C93.1 D1.C D2.C ICSP.2 JP1.2 JP6.1 JP6.2 JP6.3 JP6.4 JP6.5 JP6.6 L2.1 LCD_HEADER.10 R1.2 R2.2 R6.2 R11.2 R12.2 R13.2 R15.1 R18.2 R19.2 R20.2 R50.1 R55.1 R60.1 R64.1 R68.1 R72.1 SERVO.2 ST0.P$5 ST1.P$5 ST2.P$5 ST3.P$5 ST4.P$5 ST5.P$5 ST6.P$5 U1.P$10(VCC) U1.P$31(VCC_2) U1.P$61(VCC_3) U1.P$80(VCC_4) U1.P$100(AVCC) U2.4(VCC) U2.32(AVCC) U$2.VCC_IO U$3.VCC_IO U$4.VCC_IO U$6.VCC_IO U$9.VCC_IO U$10.VCC_IO
VCCIO: C12.1 C30.1 D6.C R14.1 U3.VIN ; supply symbol labelled +12V2
VDD: HB_CON.3 R30.1 SD0.P$1 U$8.P$1 U$8.P$3 ; supply symbol labelled +12V3
XTAL1: Q2.1 R10.2 U1.P$34(XTAL1)
XTAL2: Q2.3 R10.1 U1.P$33(XTAL2)
Unconnected: JP3.4 JP4.4 JP5.4 JP7.4 JP8.4 JP9.4 U2.5((PCINT11_/AIN2_)_PC2) U2.6((OC.0B_/_INT0)_PD0) U2.7((AIN0_/_INT1)_PD1) U2.12((RTS_/_AIN5_/_INT6)_PD6) U2.14((~SS_/_PCINT0)_PB0) U2.18(PB4_(T1_/_PCINT4)) U2.19(PB5_(PCINT5)) U2.20(PB6_(PCINT6)) U2.21(PB7_(PCINT7_/_OC.0A_/_OC.1C)) U2.22(PC7_(INT4_/_ICP1_/_CLKO)) U2.23(PC6_(OC.1A_/_PCINT8)) U2.25(PC5_(_PCINT9/_OC.1B)) U2.26(PC4_(PCINT10)) U$2.AIN_IREF U$2.DCO U$2.SPI_MODE U$3.AIN_IREF U$3.DCO U$3.SPI_MODE U$4.AIN_IREF U$4.DCO U$4.SPI_MODE U$6.AIN_IREF U$6.DCO U$6.SPI_MODE U$9.AIN_IREF U$9.DCO U$9.SPI_MODE U$10.AIN_IREF U$10.DCO U$10.SPI_MODE

## Notes on the sheet
- Thermistor 0 | Thermistor 1 | Thermistor 2

## Library data of the parts
12V-AUX = SparkFun:M02: Header 2 Standard 2-pin 0.1" header. Use with straight break away headers (SKU : PRT-00116), right angle break away headers (PRT-00553), swiss pins (PRT-00743), machine pins (PRT-00117), and female headers (PRT-00115). Molex polarized connector foot print use with SKU : PRT-08233 with associated crimp pins and housings.
C1-C11 C21 = resistor:C-EU: CAPACITOR, European symbol
C12-C16 C22-C28 C30-C32 C35-C43 C51-C59 C61-C69 C71-C79 C81-C89 C91-C99 = rcl:C-EU: CAPACITOR, European symbol; SPICEPREFIX: C
C17-C20 C34 C50 C60 C70 C80 C90 = adafruit:CPOL-US: POLARIZED CAPACITOR, American symbol
D1 D2 = diode:DIODE-: DIODE
D3 SD0 SD1-SD6 = personal:SCHOTTKY
D6 D7 = personal:MRA4004T3G
E0 E1 FAN0 FAN1-FAN3 HB POWER RX_LED1 TX_LED2 = led:LED: LED OSRAM: - CHIPLED LG R971, LG N971, LY N971, LG Q971, LY Q971, LO R971, LY R971 LH N974, LH R974 LS Q976, LO Q976, LY Q976 LO Q996 - Hyper CHIPLED LW Q18S LB Q993, LB Q99A, LB R99A - SideLED LS A670, LO A670, LY A670, LG A670, LP A670 LB A673, LV A673, LT A673, LW A673 LH A674 LY A675 LS A676, LA A676, LO A676, LY A676, LW A676 LS A679, LY A679, LG A679 - Hyper Micro SIDELED® LS Y876, LA Y876, LO Y876, LY Y876 LT Y87S - SmartLED LW L88C, LW L88S LB L89C, LB L89S, LG L890 LS L89K, LO L89K, LY L89K LS L896, LA L896, LO L896, LY L896 - TOPLED LS T670, LO T670, LY T670, LG T670, LP T670 LSG T670, LSP T670, LSY T670, LOP T670, LYG T670 LG T671, LOG T671, LSG T671 LB T673, LV T673, LT T673, LW T673 LH T674 LS T676, LA T676, LO T676, LY T676, LB T676, LH T676, LSB T676, LW T676 LB T67C, LV T67C, LT T67C, LS T67K, LO T67K, LY T67K, LW E67C LS E67B, LA E67B, LO E67B, LY E67B, LB E67C, LV E67C, LT E67C LW T67C LS T679, LY T679, LG T679 LS T770, LO T770, LY T770, LG T770, LP T770 LB T773, LV T773, LT T773, LW T773 LH T774 LS E675, LA E675, LY E675, LS T675 LS T776, LA T776, LO T776, LY T776, LB T776 LHGB T686 LT T68C, LB T68C - Hyper Mini TOPLED® LB M676 - Mini TOPLED Santana® LG M470 LS M47K, LO M47K, LY M47K Source: http://www.osram.convergy.de LUXEON: - LUMILED® LXK2-PW12-R00, LXK2-PW12-S00, LXK2-PW14-U00, LXK2-PW14-V00 LXK2-PM12-R00, LXK2-PM12-S00, LXK2-PM14-U00 LXK2-PE12-Q00, LXK2-PE12-R00, LXK2-PE12-S00, LXK2-PE14-T00, LXK2-PE14-U00 LXK2-PB12-K00, LXK2-PB12-L00, LXK2-PB12-M00, LXK2-PB14-N00, LXK2-PB14-P00, LXK2-PB14-Q00 LXK2-PR12-L00, LXK2-PR12-M00, LXK2-PR14-Q00, LXK2-PR14-R00 LXK2-PD12-Q00, LXK2-PD12-R00, LXK2-PD12-S00 LXK2-PH12-R00, LXK2-PH12-S00 LXK2-PL12-P00, LXK2-PL12-Q00, LXK2-PL12-R00 Source: www.luxeon.com KINGBRIGHT: KA-3528ASYC Source: www.kingbright.com
ENDSTOPS = pinhead:PINHD-2X6: PIN HEADER
F1 = rcl:L-EU: INDUCTOR, European symbol; SPICEPREFIX: L
FAN-0 FAN-1-FAN-3 T0 T1 T2 = pinhead:PINHD-1X2: PIN HEADER
HB_CON = personal:POWER_CON_4
ICSP = SmartPrj:PINHD-2X3: PIN HEADER
JP1 JP3-JP5 JP7-JP9 = pinhead:PINHD-2X3: PIN HEADER
JP6 = pinhead:PINHD-1X6: PIN HEADER
L1 R1-R9 R11-R16 R18-R28 R30-R42 R44-R58 R60-R72 = rcl:R-EU_: RESISTOR, European symbol; SPICEPREFIX: R
L2 = resistor:L-EU: INDUCTOR, European symbol
LCD_HEADER SD = pinhead:PINHD-2X5: PIN HEADER
N0 N1 N2 = personal:BSC010N04LS
N3-N6 = personal:BSZ0904NSIATMA1
Q1 = crystal:CRYSTAL: CRYSTAL; OC_FARNELL: 1667008; OC_NEWARK: unknown
Q2 = murata-filter:CSTCR: Resonator Source: murata.co.jp; MPN: CSTCR6M00G53-R0; OC_FARNELL: 1170434; OC_NEWARK: 25M8759
R10 = resistor:R-EU_: RESISTOR, European symbol
S1 = switch-omron:10-XX: OMRON SWITCH; MPN: B3F-1000; OC_FARNELL: 176432; OC_NEWARK: 36M3542
SERVO = pinhead:PINHD-1X3: PIN HEADER
SJ1 SJ2 XMIN YMIN ZMIN0 ZMIN1 = jumper:SJ: SMD solder JUMPER
ST0 ST1-ST6 = personal:SN74LVC1G17
U1 = personal:ATMEGA2560
U2 = Atmel_By_element14_Batch_1-00:ATMEGA16U2-AU: 8-bit Microcontroller; MPN: ATMEGA16U2-AU; OC_FARNELL: 1841607; OC_NEWARK: 12T1292; PACKAGE: QFP-32; SUPPLIER: Atmel
U3 = personal:A4403
U$2-U$4 U$6 U$9 U$10 = personal:TRINAMIC2130
U$5 U$8 = personal:UNIVAL_FUSE
U$7 = personal:POWER_CON_6
X1 = con-berg:PN61729-S: BERG USB connector; OC_FARNELL: unknown; OC_NEWARK: unknown
X-AXIS X-AXIS2-X-AXIS6 = pinhead:PINHD-1X4: PIN HEADER
Z1 Z2 = varistor:VARISTOR: VARISTOR

## Net classes
0 default: width 0.203 mm, drill 0.3 mm, clearance 0.203 mm
2 gnd: width 0.305 mm, drill 0.406 mm, clearance 0.203 mm
3 power usb: width 0.508 mm, drill 0.406 mm, clearance 0.203 mm